# Altium schematic sheet Solar_Charger_Schematic.SchDoc
size Letter; SheetNumber: 1; SheetTotal: 1
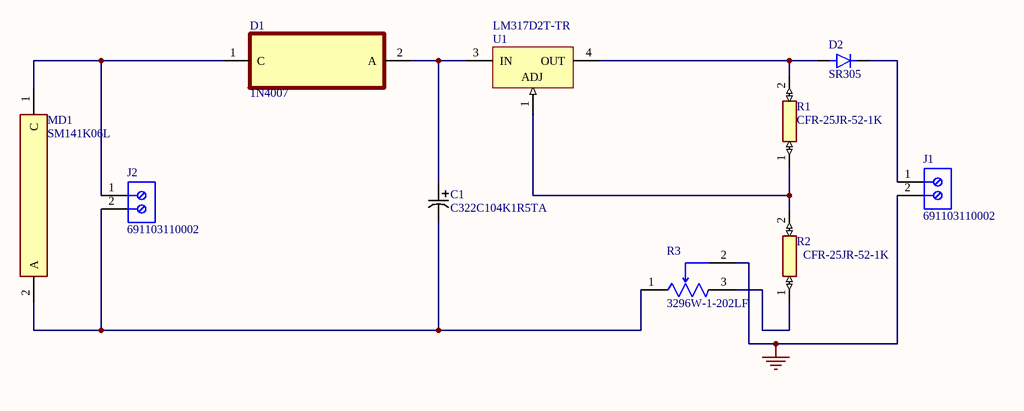
[diagram p0: Solar_Charger_Schematic.SchDoc]

## Parts
C1  C322C104K1R5TA  [CAP_C322_KEM]
D1  1N4007  [DIO_1N5282]
D2  SR305  [DIOAD1990W125L900D530]
J1  691103110002  [691103110002]
J2  691103110002  [691103110002]
MD1  SM141K06L  [FP-SM141K06L-MFG]
R1  CFR-25JR-52-1K  [RESAD1590W60L630D240]
R2  CFR-25JR-52-1K  [RESAD1590W60L630D240]
R3  3296W-1-202LF  [FP-3296W-MFG]
U1  LM317D2T-TR  [TO-263_N]

## Nets
GND: J1.2 R3.2(WIPER)
NetC1_1: C1.1 D1.2(A) U1.3(IN)
NetC1_2: C1.2 J2.2 MD1.2(A) R3.1(CCW)
NetD1_1: D1.1(C) J2.1 MD1.1(C)
NetD2_A: D2.A R1.2 U1.4(OUT)
NetD2_C: D2.C(K) J1.1
NetR1_1: R1.1 R2.2 U1.1(ADJ)
NetR2_1: R2.1 R3.3(CW)

## Library data of the parts
C1 = C322C104K1R5TA: No Description Available; Mfr_Name: Kemet; Type: DEV; Copyright: Copyright (C) 2023 Ultra Librarian. All rights reserved.; Manufacturer_Part_Number: C322C104K1R5TA; RefDes: RefDes
D1 = 1N4007: Diode 1000 V 1A Through Hole DO-41; MF: ON; MP: 1N5282; Package: None; Price: None; Check_prices: https://www.snapeda.com/parts/1N5282/Onsemi/view-part/?ref=eda; Value: *; SnapEDA_Link: https://www.snapeda.com/parts/1N5282/Onsemi/view-part/?ref=snap; Availability: In Stock; Purchase-URL: https://pricing.snapeda.com/search/part/1N5282/?ref=eda
D2 = SR305: 3A, 50V, Schottky Rectifier; MF: Taiwan Semiconductor; Check_prices: https://www.snapeda.com/parts/SR305/Taiwan+Semiconductor/view-part/?ref=eda; Price: None; Availability: In Stock; Package: SMD-2-2 Avago; SnapEDA_Link: https://www.snapeda.com/parts/SR305/Taiwan+Semiconductor/view-part/?ref=snap; Value: *; MP: SR305
J1 J2 = Terminal_Block: NexarPartId: 18818286; Pitch: 3.5052mm; Current Rating: 10A; Number of Positions Per Level: 2; Plating: Steel; Number of Levels: 1; Voltage: 125V; Wire/Cable Gauge: 26AWG; Stripping Length: -6mm; Wire Gauge (Min): 16AWG; Packaging: Box; Number of Rows: 1; Color: Blue; Height: 8.5mm; Current: 10A; Lead Pitch: 3.5mm; RoHS: Compliant; Housing Material: Nylon; Width: 8mm; Length: 7mm; Contact Plating: Tin; Number of Pins: 2; Mount: Through Hole; Min Operating Temperature: -40°C; Number of Contacts: 2; REACH SVHC: Unknown; Termination: Screw; Wire Gauge (Max): 26AWG; Max Operating Temperature: 105°C; Voltage Rating: 125V; Contact Material: Brass, Copper, Nickel, Tin, Zinc
MD1 = CMP-48341-000002-1: MONOCRYST SOLAR CELL 184MW 4.15V
R1 R2 = CFR-25JR-52-1K: 1.1 kOhms Â±5% 0.25W, 1/4W Through Hole Resistor Axial - Carbon Film; MF: Yageo; SnapEDA_Link: https://www.snapeda.com/parts/CFR-25JR-52-1K/Yageo/view-part/?ref=snap; Package: Axial Yageo; Value: *; MP: CFR-25JR-52-1K; Check_prices: https://www.snapeda.com/parts/CFR-25JR-52-1K/Yageo/view-part/?ref=eda
R3 = CMP-2000-05582-2: TRIMMER 2K OHM 0.5W PC PIN TOP; Resistance Tolerance: 10%; Max Power Dissipation: 500mW; Number of Turns: 25; Temperature Coefficient: 100ppm/°C; Resistance: 2kR; Taper: Linear; Width: 9.53mm; Radiation Hardening: No; Length: 9.53mm; Packaging: Rail/Tube; Lead Free: Lead Free; Mount: Panel; Min Operating Temperature: -55°C; Power Rating: 500mW; RoHS Compliant: Yes; REACH SVHC: No SVHC; Color: Blue; Package Quantity: 50; Contact Plating: Tin; Weight: 0.03oz; Technology: CERMET; Max Operating Temperature: 125°C; Tolerance: 10%; Termination: Pin; Resistor Type: Cermet; Military Standard: Not; Height: 0.395inch; Series: 3296; Depth: 4.83mm
U1 = CMP-0244-00094-1: 1.5A, 1.2V to 37V Adjustable Voltage Regulator, 3-Pin D2PAK, Tape and Reel; DatasheetVersion: 1/11/2011; PackageVersion: 2011; PackageDescription: 3-Pin Transistor Outline Package 2.54 mm Pitch, 15.4 mm Lead Span (D2PAK); ComponentLink2URL: http://www.st.com/internet/com/TECHNICAL_RESOURCES/TECHNICAL_LITERATURE/DATASHEET/CD00000455.pdf; PackageReference: TO-263; ComponentLink1Description: Manufacturer URL; ComponentLink2Description: Datasheet; ComponentLink1URL: http://www.st.com